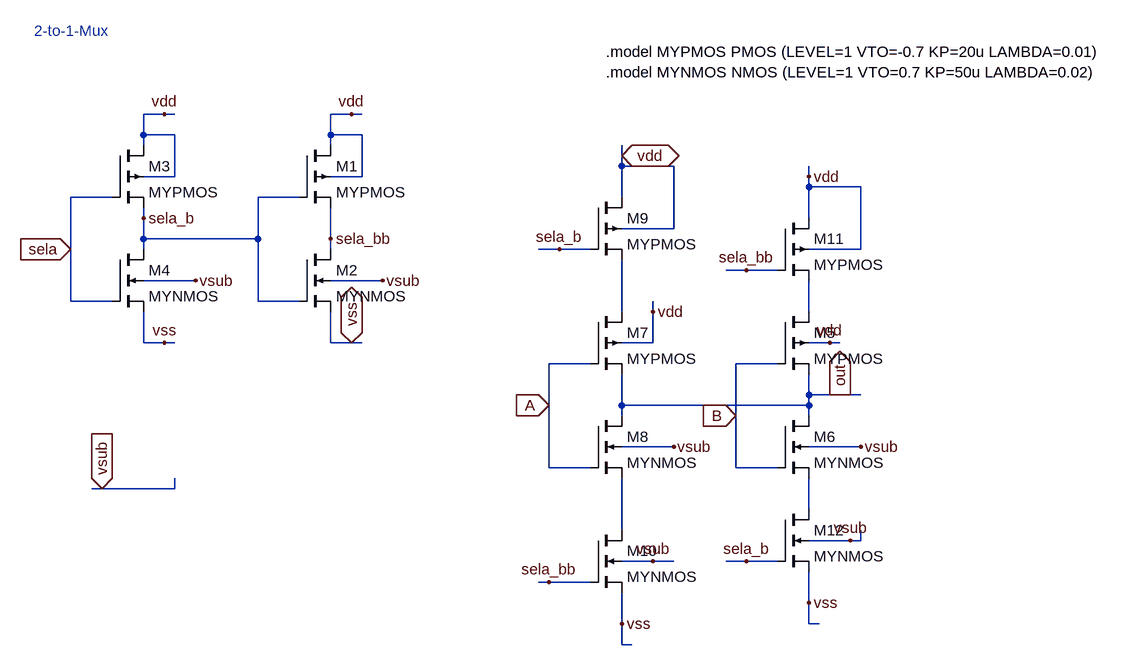
[diagram p0: schematic dsproj_2to1mux.asc]
dsproj_2to1mux.asc, the LTspice schematic file:
Version 4.1
SHEET 1 1264 680
WIRE -208 -432 -240 -432
WIRE -192 -432 -208 -432
WIRE 80 -432 48 -432
WIRE 96 -432 80 -432
WIRE -240 -400 -240 -432
WIRE -192 -400 -240 -400
WIRE 48 -400 48 -432
WIRE 96 -400 48 -400
WIRE -240 -384 -240 -400
WIRE 48 -384 48 -400
WIRE 496 -368 496 -384
WIRE 496 -352 496 -368
WIRE 576 -352 496 -352
WIRE -192 -336 -192 -400
WIRE -192 -336 -240 -336
WIRE 96 -336 96 -400
WIRE 96 -336 48 -336
WIRE 784 -336 784 -352
WIRE 784 -320 784 -336
WIRE 864 -320 784 -320
WIRE -288 -304 -352 -304
WIRE 0 -304 -64 -304
WIRE 496 -304 496 -352
WIRE -240 -272 -240 -288
WIRE 784 -272 784 -320
WIRE 576 -256 576 -352
WIRE 576 -256 496 -256
WIRE -240 -240 -240 -272
WIRE -64 -240 -64 -304
WIRE -64 -240 -240 -240
WIRE 48 -240 48 -288
WIRE -352 -224 -352 -304
WIRE -240 -224 -240 -240
WIRE 48 -224 48 -240
WIRE 400 -224 368 -224
WIRE 448 -224 400 -224
WIRE 864 -224 864 -320
WIRE 864 -224 784 -224
WIRE 688 -192 656 -192
WIRE 736 -192 688 -192
WIRE -160 -176 -240 -176
WIRE 128 -176 48 -176
WIRE -352 -144 -352 -224
WIRE -288 -144 -352 -144
WIRE -64 -144 -64 -240
WIRE 0 -144 -64 -144
WIRE 496 -128 496 -208
WIRE 544 -128 544 -144
WIRE 784 -128 784 -176
WIRE -240 -80 -240 -128
WIRE -208 -80 -240 -80
WIRE -192 -80 -208 -80
WIRE 48 -80 48 -128
WIRE 80 -80 48 -80
WIRE 96 -80 80 -80
WIRE 544 -80 544 -128
WIRE 544 -80 496 -80
WIRE 816 -80 784 -80
WIRE 832 -80 816 -80
WIRE 448 -48 384 -48
WIRE 736 -48 672 -48
WIRE 784 0 784 -32
WIRE 832 0 784 0
WIRE 864 0 832 0
WIRE 384 16 384 -48
WIRE 496 16 496 -32
WIRE 784 16 784 0
WIRE 784 16 496 16
WIRE 496 32 496 16
WIRE 672 32 672 -48
WIRE 784 32 784 16
WIRE 576 80 496 80
WIRE 864 80 784 80
WIRE 384 112 384 16
WIRE 448 112 384 112
WIRE 672 112 672 32
WIRE 736 112 672 112
WIRE -304 144 -320 144
WIRE -192 144 -192 128
WIRE -192 144 -304 144
WIRE 784 176 784 128
WIRE 496 208 496 128
WIRE 848 224 784 224
WIRE 864 224 864 208
WIRE 864 224 848 224
WIRE 544 256 496 256
WIRE 576 256 544 256
WIRE 688 256 656 256
WIRE 736 256 688 256
WIRE 384 288 368 288
WIRE 448 288 384 288
WIRE 784 320 784 272
WIRE 496 352 496 304
WIRE 784 352 784 320
WIRE 800 352 784 352
WIRE 496 384 496 352
WIRE 512 384 496 384
FLAG -208 -432 vdd
FLAG 80 -432 vdd
FLAG -208 -80 vss
FLAG 80 -80 vss
IOPIN 80 -80 BiDir
FLAG -160 -176 vsub
FLAG 128 -176 vsub
FLAG 576 80 vsub
FLAG 864 80 vsub
FLAG 384 16 A
IOPIN 384 16 In
FLAG -352 -224 sela
IOPIN -352 -224 In
FLAG -240 -272 sela_b
FLAG 48 -240 sela_bb
FLAG 400 -224 sela_b
FLAG 384 288 sela_bb
FLAG 496 -368 vdd
IOPIN 496 -368 BiDir
FLAG 496 352 vss
FLAG 544 -128 vdd
FLAG 816 -80 vdd
FLAG 544 256 vsub
FLAG 848 224 vsub
FLAG 784 320 vss
FLAG 688 -192 sela_bb
FLAG 688 256 sela_b
FLAG 672 32 B
IOPIN 672 32 In
FLAG 784 -336 vdd
FLAG 832 0 out
IOPIN 832 0 Out
FLAG -304 144 vsub
IOPIN -304 144 In
SYMBOL pmos4 0 -384 R0
SYMATTR InstName M1
SYMATTR Value MYPMOS
SYMATTR Value2 l=180e-9 w=2400e-9
SYMBOL nmos4 0 -224 R0
SYMATTR InstName M2
SYMATTR Value MYNMOS
SYMATTR Value2 l=180e-9 w=1200e-9
SYMBOL pmos4 -288 -384 R0
SYMATTR InstName M3
SYMATTR Value MYPMOS
SYMATTR Value2 l=180e-9 w=2400e-9
SYMBOL nmos4 -288 -224 R0
SYMATTR InstName M4
SYMATTR Value MYNMOS
SYMATTR Value2 l=180e-9 w=1200e-9
SYMBOL pmos4 736 -128 R0
SYMATTR InstName M5
SYMATTR Value MYPMOS
SYMATTR Value2 l=180e-9 w=2400e-9
SYMBOL nmos4 736 32 R0
SYMATTR InstName M6
SYMATTR Value MYNMOS
SYMATTR Value2 l=180e-9 w=1200e-9
SYMBOL pmos4 448 -128 R0
SYMATTR InstName M7
SYMATTR Value MYPMOS
SYMATTR Value2 l=180e-9 w=2400e-9
SYMBOL nmos4 448 32 R0
SYMATTR InstName M8
SYMATTR Value MYNMOS
SYMATTR Value2 l=180e-9 w=1200e-9
SYMBOL pmos4 448 -304 R0
SYMATTR InstName M9
SYMATTR Value MYPMOS
SYMATTR Value2 l=180e-9 w=2400e-9
SYMBOL nmos4 448 208 R0
SYMATTR InstName M10
SYMATTR Value MYNMOS
SYMATTR Value2 l=180e-9 w=1200e-9
SYMBOL pmos4 736 -272 R0
SYMATTR InstName M11
SYMATTR Value MYPMOS
SYMATTR Value2 l=180e-9 w=2400e-9
SYMBOL nmos4 736 176 R0
SYMATTR InstName M12
SYMATTR Value MYNMOS
SYMATTR Value2 l=180e-9 w=1200e-9
TEXT -408 -560 Left 2 ;2-to-1-Mux
TEXT 472 -528 Left 2 !.model MYPMOS PMOS (LEVEL=1 VTO=-0.7 KP=20u LAMBDA=0.01)\n.model MYNMOS NMOS (LEVEL=1 VTO=0.7 KP=50u LAMBDA=0.02)

The netlist it stands for:
* dsproj_2to1mux.asc
M1 vdd sela_b sela_bb vdd MYPMOS l=180e-9 w=2400e-9
M2 sela_bb sela_b vss vsub MYNMOS l=180e-9 w=1200e-9
M3 vdd sela sela_b vdd MYPMOS l=180e-9 w=2400e-9
M4 sela_b sela vss vsub MYNMOS l=180e-9 w=1200e-9
M5 N002 B out vdd MYPMOS l=180e-9 w=2400e-9
M6 out B N003 vsub MYNMOS l=180e-9 w=1200e-9
M7 N001 A out vdd MYPMOS l=180e-9 w=2400e-9
M8 out A N004 vsub MYNMOS l=180e-9 w=1200e-9
M9 vdd sela_b N001 vdd MYPMOS l=180e-9 w=2400e-9
M10 N004 sela_bb vss vsub MYNMOS l=180e-9 w=1200e-9
M11 vdd sela_bb N002 vdd MYPMOS l=180e-9 w=2400e-9
M12 N003 sela_b vss vsub MYNMOS l=180e-9 w=1200e-9
.model NMOS NMOS
.model PMOS PMOS
.lib standard.mos
* 2-to-1-Mux
.model MYPMOS PMOS (LEVEL=1 VTO=-0.7 KP=20u LAMBDA=0.01)
.model MYNMOS NMOS (LEVEL=1 VTO=0.7 KP=50u LAMBDA=0.02)
.backanno
.end